# EAGLE design main (EAGLE 7.6.0)
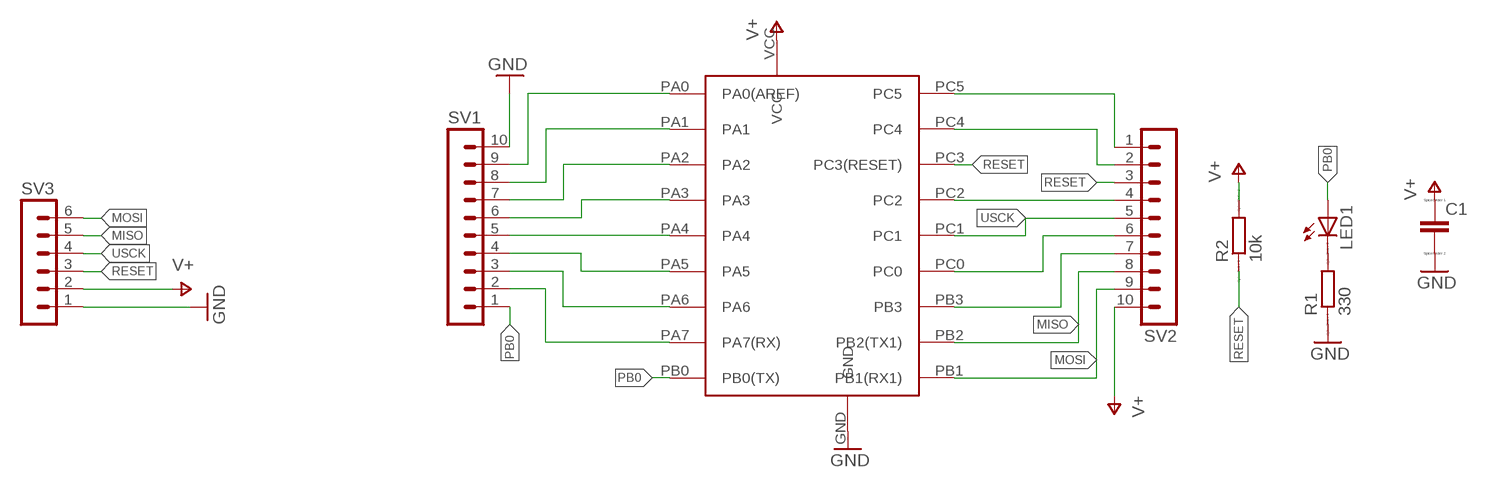
[diagram p0: schematic, sheet 1]

## Parts
C1  CC0603  [C0603]
LED1  LEDCHIP-LED0603  [CHIP-LED0603]
R1  330  RR0603  [R0603]
R2  10k  RR0603  [R0603]
SV1  MA10-1  [MA10-1]
SV2  MA10-1  [MA10-1]
SV3  MA06-1  [MA06-1]
U$1  ATTINY1634  [SOIC20]

## Nets
GND: C1.2 R1.1 SV1.10 SV3.1 U$1.GND
MISO: SV2.8 SV3.5 U$1.PB2(PB2(TX1))
MOSI: SV2.9 SV3.6 U$1.PB1(PB1(RX1))
N$1: LED1.C R1.2
N$2: SV2.1 U$1.PC5
N$3: SV2.2 U$1.PC4
N$4: SV1.9 U$1.PA0(PA0(AREF))
N$8: SV2.7 U$1.PB3
N$9: SV2.6 U$1.PC0
N$10: SV1.8 U$1.PA1
N$11: SV1.7 U$1.PA2
N$12: SV1.6 U$1.PA3
N$13: SV1.5 U$1.PA4
N$14: SV1.2 U$1.PA7(PA7(RX))
N$15: SV1.3 U$1.PA6
N$16: SV1.4 U$1.PA5
N$17: SV2.4 U$1.PC2
PB0: LED1.A SV1.1 U$1.PB0(PB0(TX))
RESET: R2.1 SV2.3 SV3.3 U$1.PC3(PC3(RESET))
USCK: SV2.5 SV3.4 U$1.PC1
V+: C1.1 R2.2 SV2.10 SV3.2 U$1.VCC

## Library data of the parts
C1 = eagle-ltspice:C: CAPACITOR, European symbol; SPICEMODEL: NONE; SPICEPREFIX: C
LED1 = adafruit:LED: LED OSRAM: - CHIPLED LG R971, LG N971, LY N971, LG Q971, LY Q971, LO R971, LY R971 LH N974, LH R974 LS Q976, LO Q976, LY Q976 LO Q996 - Hyper CHIPLED LW Q18S LB Q993, LB Q99A, LB R99A - SideLED LS A670, LO A670, LY A670, LG A670, LP A670 LB A673, LV A673, LT A673, LW A673 LH A674 LY A675 LS A676, LA A676, LO A676, LY A676, LW A676 LS A679, LY A679, LG A679 - Hyper Micro SIDELED® LS Y876, LA Y876, LO Y876, LY Y876 LT Y87S - SmartLED LW L88C, LW L88S LB L89C, LB L89S, LG L890 LS L89K, LO L89K, LY L89K LS L896, LA L896, LO L896, LY L896 - TOPLED LS T670, LO T670, LY T670, LG T670, LP T670 LSG T670, LSP T670, LSY T670, LOP T670, LYG T670 LG T671, LOG T671, LSG T671 LB T673, LV T673, LT T673, LW T673 LH T674 LS T676, LA T676, LO T676, LY T676, LB T676, LH T676, LSB T676, LW T676 LB T67C, LV T67C, LT T67C, LS T67K, LO T67K, LY T67K, LW E67C LS E67B, LA E67B, LO E67B, LY E67B, LB E67C, LV E67C, LT E67C LW T67C LS T679, LY T679, LG T679 LS T770, LO T770, LY T770, LG T770, LP T770 LB T773, LV T773, LT T773, LW T773 LH T774 LS E675, LA E675, LY E675, LS T675 LS T776, LA T776, LO T776, LY T776, LB T776 LHGB T686 LT T68C, LB T68C - Hyper Mini TOPLED® LB M676 - Mini TOPLED Santana® LG M470 LS M47K, LO M47K, LY M47K Source: http://www.osram.convergy.de/
R1 R2 = eagle-ltspice:R: RESISTOR, European symbol; SPICEMODEL: NONE; SPICEPREFIX: R
SV1 SV2 = con-lstb:MA10-1: PIN HEADER; OC_FARNELL: unknown; OC_NEWARK: unknown
SV3 = con-lstb:MA06-1: PIN HEADER; OC_FARNELL: unknown; OC_NEWARK: unknown
U$1 = 7_segment_lib:ATTINY1634

## Board
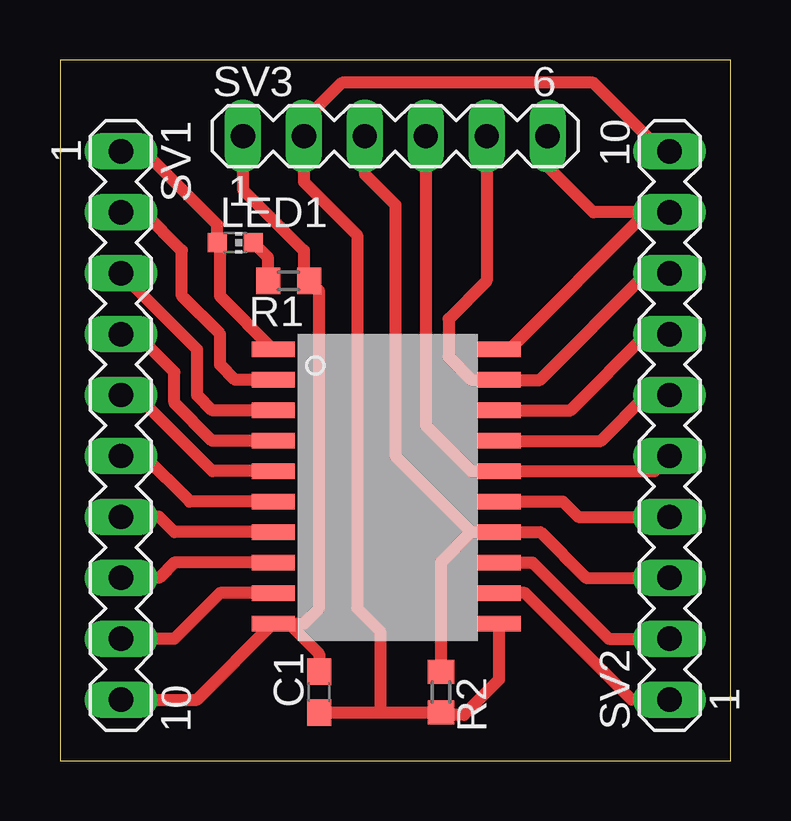
[diagram p1: board, top side]

Size 27.94 x 29.21 mm. Coordinates in mm from the lower left corner, seen from the top.
Outline: 0,0 27.94,0 27.94,29.21 0,29.21 0,0
Copper layers (1*16): Top 0.035mm / dielectric 1.5mm / Bottom 0.035mm
Design rules "default": minimum track width 10mil, minimum drill 24mil, track to track 8mil, track to pad 8mil, pad to pad 8mil, via to via 8mil, smd to smd 8mil, copper to edge 40mil, drill to drill 8mil, minimum pad ring 10mil, minimum via ring 8mil, stop-mask expansion 4mil, vias tented up to drill 0mil, thermal gap 10mil

### Footprints (pad centres in the part's own frame; a part is rotated, then mirrored left to right if it is on the bottom)
C0603 = smd 1.1 x 1: 1 -0.85,0; 2 0.85,0
CHIP-LED0603 = smd 0.8 x 0.8: A 0,-0.75; C 0,0.75
R0603 = smd 1 x 1.1: 1 -0.85,0; 2 0.85,0
MA10-1 = drill 1.016 long: 1 -11.43,0; 2 -8.89,0; 3 -6.35,0; 4 -3.81,0; 5 -1.27,0; 6 1.27,0; 7 3.81,0; 8 6.35,0; 9 8.89,0; 10 11.43,0
MA06-1 = drill 1.016 long: 1 -6.35,0; 2 -3.81,0; 3 -1.27,0; 4 1.27,0; 5 3.81,0; 6 6.35,0
SOIC20 = smd 1.8 x 0.65: GND 0,0; PA0 0,1.27; PA1 0,2.54; PA2 0,3.81; PA3 0,5.08; PA4 0,6.35; PA5 0,7.62; PA6 0,8.89; PA7 0,10.16; PB0 0,11.43; PB1 9.4,11.43; PB2 9.4,10.16; PB3 9.4,8.89; PC0 9.4,7.62; PC1 9.4,6.35; PC2 9.4,5.08; PC3 9.4,3.81; PC4 9.4,2.54; PC5 9.4,1.27; VCC 9.4,0

### Placement (x,y rotation side)
C1  10.79,2.86 90 top
LED1  7.3,21.59 270 top
R1  9.52,20 180 top
R2  15.87,2.86 270 top
SV1  2.54,13.97 270 top
SV2  25.4,13.97 90 top
SV3  13.97,26.04 0 top
U$1  8.89,5.71 0 top

### Tracks (layer width: path | path; a pad name or v marks a point on that pad's centre or on a via)
GND
  Top 0.508: SV1.10 5.71,2.54 U$1.GND | U$1.GND 9.52,5.71 10.8,4.45 C1.2 | U$1.GND 10.16,5.71 10.8,6.35 10.8,19.58 R1.1 10.16,20.22 10.16,21.27 7.62,23.81 SV3.1
MISO
  Top 0.508: SV2.8 24.45,20.32 20,15.87 U$1.PB2 17.14,15.87 16.19,16.83 16.19,18.42 17.78,20 SV3.5
MOSI
  Top 0.508: U$1.PB1 18.73,17.15 24.45,22.86 | 24.45,22.86 SV2.9 | 24.45,22.86 22.23,22.86 20.32,24.77 SV3.6
N$1
  Top 0.508: R1.2 8.67,20.97 LED1.C
N$2
  Top 0.508: SV2.1 23.81,2.54 19.37,6.99 U$1.PC5
N$3
  Top 0.508: U$1.PC4 19.69,8.26 22.86,5.08 SV2.2
N$4
  Top 0.508: U$1.PA0 6.67,6.99 4.76,5.08 SV1.9
N$8
  Top 0.508: U$1.PB3 21.27,14.6 24.45,17.78 SV2.7
N$9
  Top 0.508: U$1.PC0 22.54,13.34 24.45,15.24 SV2.6
N$10
  Top 0.508: U$1.PA1 4.76,8.26 4.13,7.62 SV1.8
N$11
  Top 0.508: U$1.PA2 4.76,9.52 4.13,10.16 SV1.7
N$12
  Top 0.508: U$1.PA3 5.4,10.79 3.49,12.7 SV1.6
N$13
  Top 0.508: U$1.PA4 6.35,12.07 3.18,15.24 SV1.5
N$14
  Top 0.508: U$1.PA7 7.3,15.87 6.67,16.51 6.67,17.78 5.08,19.37 5.08,21.27 3.49,22.86 SV1.2
N$15
  Top 0.508: U$1.PA6 6.35,14.6 5.71,15.24 5.71,17.15 SV1.3
N$16
  Top 0.508: U$1.PA5 6.35,13.34 4.76,14.92 4.76,16.19 3.18,17.78 SV1.4
N$17
  Top 0.508: U$1.PC2 20.96,10.79 21.59,10.16 SV2.4
PB0
  Top 0.508: U$1.PB0 6.67,19.37 6.67,21.47 LED1.A 6.55,22.34 3.49,25.4 SV1.1
RESET
  Top 0.508: R2.1 15.87,8.26 17.14,9.52 | 17.14,9.52 U$1.PC3 20,9.52 21.91,7.62 SV2.3 | SV3.3 12.7,24.45 13.97,23.18 13.97,12.7 17.14,9.52
USCK
  Top 0.508: SV2.5 24.76,12.07 U$1.PC1 17.14,12.07 15.24,13.97 SV3.4
V+
  Top 0.508: C1.1 13.33,2.01 | 13.33,2.01 R2.2 15.98,1.9 16.83,1.9 18.29,3.37 U$1.VCC | 13.33,2.01 13.33,5.4 12.38,6.35 12.38,21.91 10.16,24.13 SV3.2 10.16,26.67 11.75,28.26 22.23,28.26 25.08,25.4 SV2.10